# Altium schematic sheet PC1_Dual_Microphone.SchDoc
size 250 x 200 mm
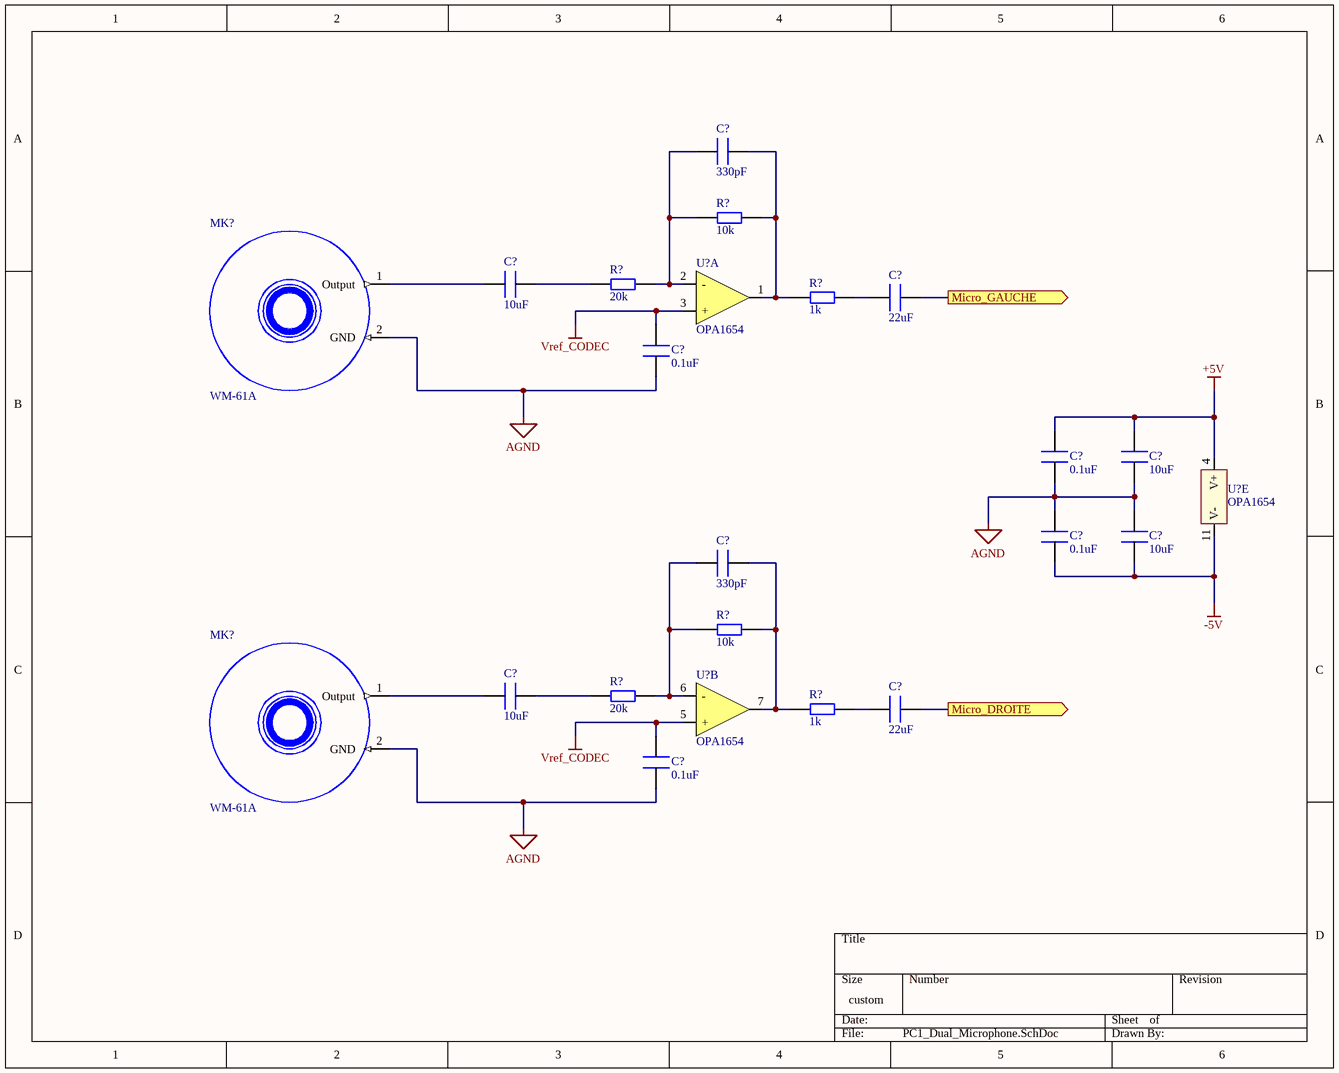
[diagram p0: PC1_Dual_Microphone.SchDoc]

## Parts
(Parts that share a designator on the sheet are numbered #1, #2 ... from top to bottom, then left to right.)
C?#1  Valeur: 330pF  (hidden comment: Condo)
C?#2  Valeur: 10uF  (hidden comment: Condo)
C?#3  Valeur: 22uF  (hidden comment: Condo)
C?#4  Valeur: 0.1uF  (hidden comment: Condo)
C?#5  Valeur: 0.1uF  (hidden comment: Condo)
C?#6  Valeur: 10uF  (hidden comment: Condo)
C?#7  Valeur: 330pF  (hidden comment: Condo)
C?#8  Valeur: 0.1uF  (hidden comment: Condo)
C?#9  Valeur: 10uF  (hidden comment: Condo)
C?#10  Valeur: 10uF  (hidden comment: Condo)
C?#11  Valeur: 22uF  (hidden comment: Condo)
C?#12  Valeur: 0.1uF  (hidden comment: Condo)
MK?#1  WM-61A
MK?#2  WM-61A
R?#1  Valeur: 10k  (hidden comment: Res)
R?#2  Valeur: 20k  (hidden comment: Res)
R?#3  Valeur: 1k  (hidden comment: Res)
R?#4  Valeur: 10k  (hidden comment: Res)
R?#5  Valeur: 20k  (hidden comment: Res)
R?#6  Valeur: 1k  (hidden comment: Res)
U?#1  OPA1654  (part A of 5)
U?#2  OPA1654  (part E of 5)
U?#3  OPA1654  (part B of 5)

## Ports
Micro_DROITE (out), Micro_GAUCHE (out)

## Nets
+5V: C?#5.2 C?#6.2 U?#2.4(V+)
-5V: C?#8.1 C?#9.1 U?#2.11(V-)
AGND: C?#4.1 C?#5.1 C?#6.1 C?#8.2 C?#9.2 C?#12.1 MK?#1.2(GND) MK?#2.2(GND)
Vref_CODEC: C?#4.2 C?#12.2 U?#1.3(+) U?#3.5(+)
Micro_DROITE: C?#11.2 ; port Micro_DROITE
Micro_GAUCHE: C?#3.2 ; port Micro_GAUCHE
NetC?#1_1: C?#1.1 R?#1.2 R?#3.1 U?#1.1(OUT)
NetC?#1_2: C?#1.2 R?#1.1 R?#2.2 U?#1.2(-)
NetC?#2_1: C?#2.1 MK?#1.1(Output)
NetC?#2_2: C?#2.2 R?#2.1
NetC?#3_1: C?#3.1 R?#3.2
NetC?#7_1: C?#7.1 R?#4.2 R?#6.1 U?#3.7(OUT)
NetC?#7_2: C?#7.2 R?#4.1 R?#5.2 U?#3.6(-)
NetC?#10_1: C?#10.1 MK?#2.1(Output)
NetC?#10_2: C?#10.2 R?#5.1
NetC?#11_1: C?#11.1 R?#6.2

## Library data of the parts
C?#1-C?#12 = Condo: Condensateur
MK?#1 MK?#2 = WM-61A: Microphone (sur Header); Fabricant: INSIKES; RefFabricant: WM-61A; DataSheet: https://components101.com/sites/default/files/component_datasheet/Electret%20Condenser%20Microphone.pdf
R?#1-R?#6 = Res: Résistance
U?#1-U?#3 = OPA1654: Quad Audio AmpliOp; Fabricant: TEXAS INSTRUMENTS; RefFabricant: OPA1654; DataSheet: http://www.ti.com/lit/ds/symlink/opa1654.pdf